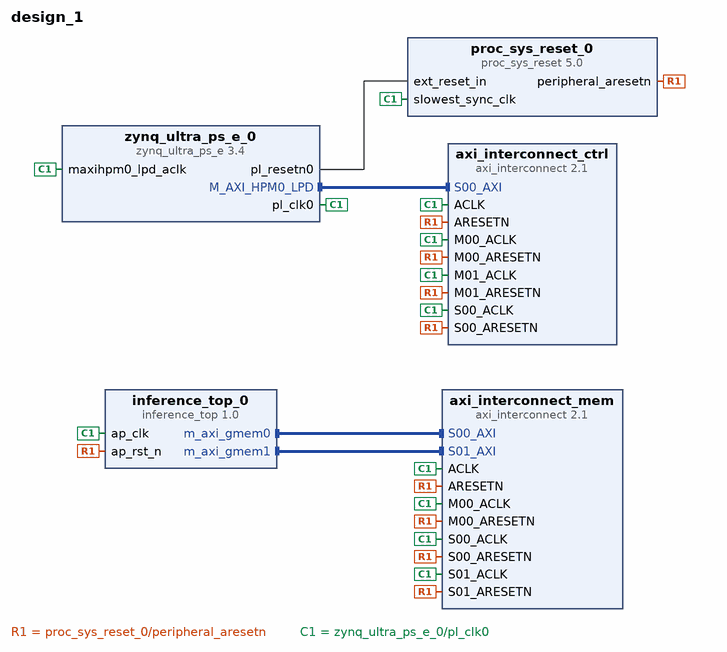
[diagram p0: block diagram of the top level]
# Vivado block design design_1, xck26-sfvc784-2LV-c, Vivado 2022.2
create_bd_design design_1

create_bd_cell -type ip -vlnv xilinx.com:ip:zynq_ultra_ps_e:3.4 zynq_ultra_ps_e_0
set_property -dict {CONFIG.PSU__DDR_HIGH_ADDRESS_GUI_ENABLE 0} [get_bd_cells zynq_ultra_ps_e_0]
# 2 more settings of zynq_ultra_ps_e_0 are not shown: defaults, MIO pin electricals, DDR timing, and values the tool derives
create_bd_cell -type ip -vlnv xilinx.com:ip:proc_sys_reset:5.0 proc_sys_reset_0
create_bd_cell -type ip -vlnv xilinx.com:hls:inference_top:1.0 inference_top_0
create_bd_cell -type ip -vlnv xilinx.com:ip:axi_interconnect:2.1 axi_interconnect_ctrl
set_property -dict {CONFIG.NUM_MI 2 CONFIG.NUM_SI 1} [get_bd_cells axi_interconnect_ctrl]
create_bd_cell -type ip -vlnv xilinx.com:ip:axi_interconnect:2.1 axi_interconnect_mem
set_property -dict {CONFIG.NUM_MI 1 CONFIG.NUM_SI 2} [get_bd_cells axi_interconnect_mem]

# ---- connections ----

connect_bd_intf_net [get_bd_intf_pins inference_top_0/m_axi_gmem0] [get_bd_intf_pins axi_interconnect_mem/S00_AXI]
connect_bd_intf_net [get_bd_intf_pins inference_top_0/m_axi_gmem1] [get_bd_intf_pins axi_interconnect_mem/S01_AXI]
connect_bd_intf_net [get_bd_intf_pins zynq_ultra_ps_e_0/M_AXI_HPM0_LPD] [get_bd_intf_pins axi_interconnect_ctrl/S00_AXI]
connect_bd_net -net ARESETN_1 [get_bd_pins proc_sys_reset_0/peripheral_aresetn] \
  [get_bd_pins axi_interconnect_ctrl/ARESETN] [get_bd_pins axi_interconnect_ctrl/S00_ARESETN] \
  [get_bd_pins axi_interconnect_ctrl/M00_ARESETN] [get_bd_pins axi_interconnect_ctrl/M01_ARESETN] \
  [get_bd_pins axi_interconnect_mem/ARESETN] [get_bd_pins axi_interconnect_mem/S00_ARESETN] \
  [get_bd_pins axi_interconnect_mem/S01_ARESETN] [get_bd_pins axi_interconnect_mem/M00_ARESETN] \
  [get_bd_pins inference_top_0/ap_rst_n]
connect_bd_net [get_bd_pins zynq_ultra_ps_e_0/pl_clk0] \
  [get_bd_pins proc_sys_reset_0/slowest_sync_clk] [get_bd_pins axi_interconnect_ctrl/ACLK] \
  [get_bd_pins axi_interconnect_ctrl/S00_ACLK] [get_bd_pins axi_interconnect_ctrl/M00_ACLK] \
  [get_bd_pins axi_interconnect_ctrl/M01_ACLK] [get_bd_pins axi_interconnect_mem/ACLK] \
  [get_bd_pins axi_interconnect_mem/S00_ACLK] [get_bd_pins axi_interconnect_mem/S01_ACLK] \
  [get_bd_pins axi_interconnect_mem/M00_ACLK] [get_bd_pins inference_top_0/ap_clk] \
  [get_bd_pins zynq_ultra_ps_e_0/maxihpm0_lpd_aclk]
connect_bd_net [get_bd_pins zynq_ultra_ps_e_0/pl_resetn0] [get_bd_pins proc_sys_reset_0/ext_reset_in]

validate_bd_design
save_bd_design
